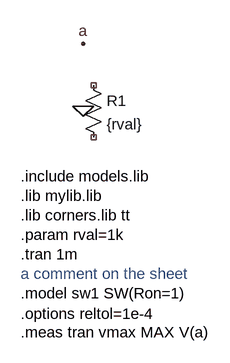
[diagram p0: schematic directives.asc]
directives.asc, the LTspice schematic file:
Version 4
SHEET 1 880 680
SYMBOL res 96 144 R0
SYMATTR InstName R1
SYMATTR Value {rval}
FLAG 96 96 a
FLAG 96 192 0
TEXT 0 300 Left 2 !.include models.lib
TEXT 0 330 Left 2 !.lib mylib.lib
TEXT 0 360 Left 2 !.lib corners.lib tt
TEXT 0 390 Left 2 !.param rval=1k
TEXT 0 420 Left 2 !.tran 1m
TEXT 0 450 Left 2 ;a comment on the sheet
TEXT 0 480 Left 2 !.model sw1 SW(Ron=1)\n.options reltol=1e-4
TEXT 0 540 Left 2 !.meas tran vmax MAX V(a)

The netlist it stands for:
* directives.asc
R1 NC_01 NC_02 {rval}
.include models.lib
.lib mylib.lib
.lib corners.lib tt
.param rval=1k
.tran 1m
* a comment on the sheet
.model sw1 SW(Ron=1)
.options reltol=1e-4
.meas tran vmax MAX V(a)
.backanno
.end